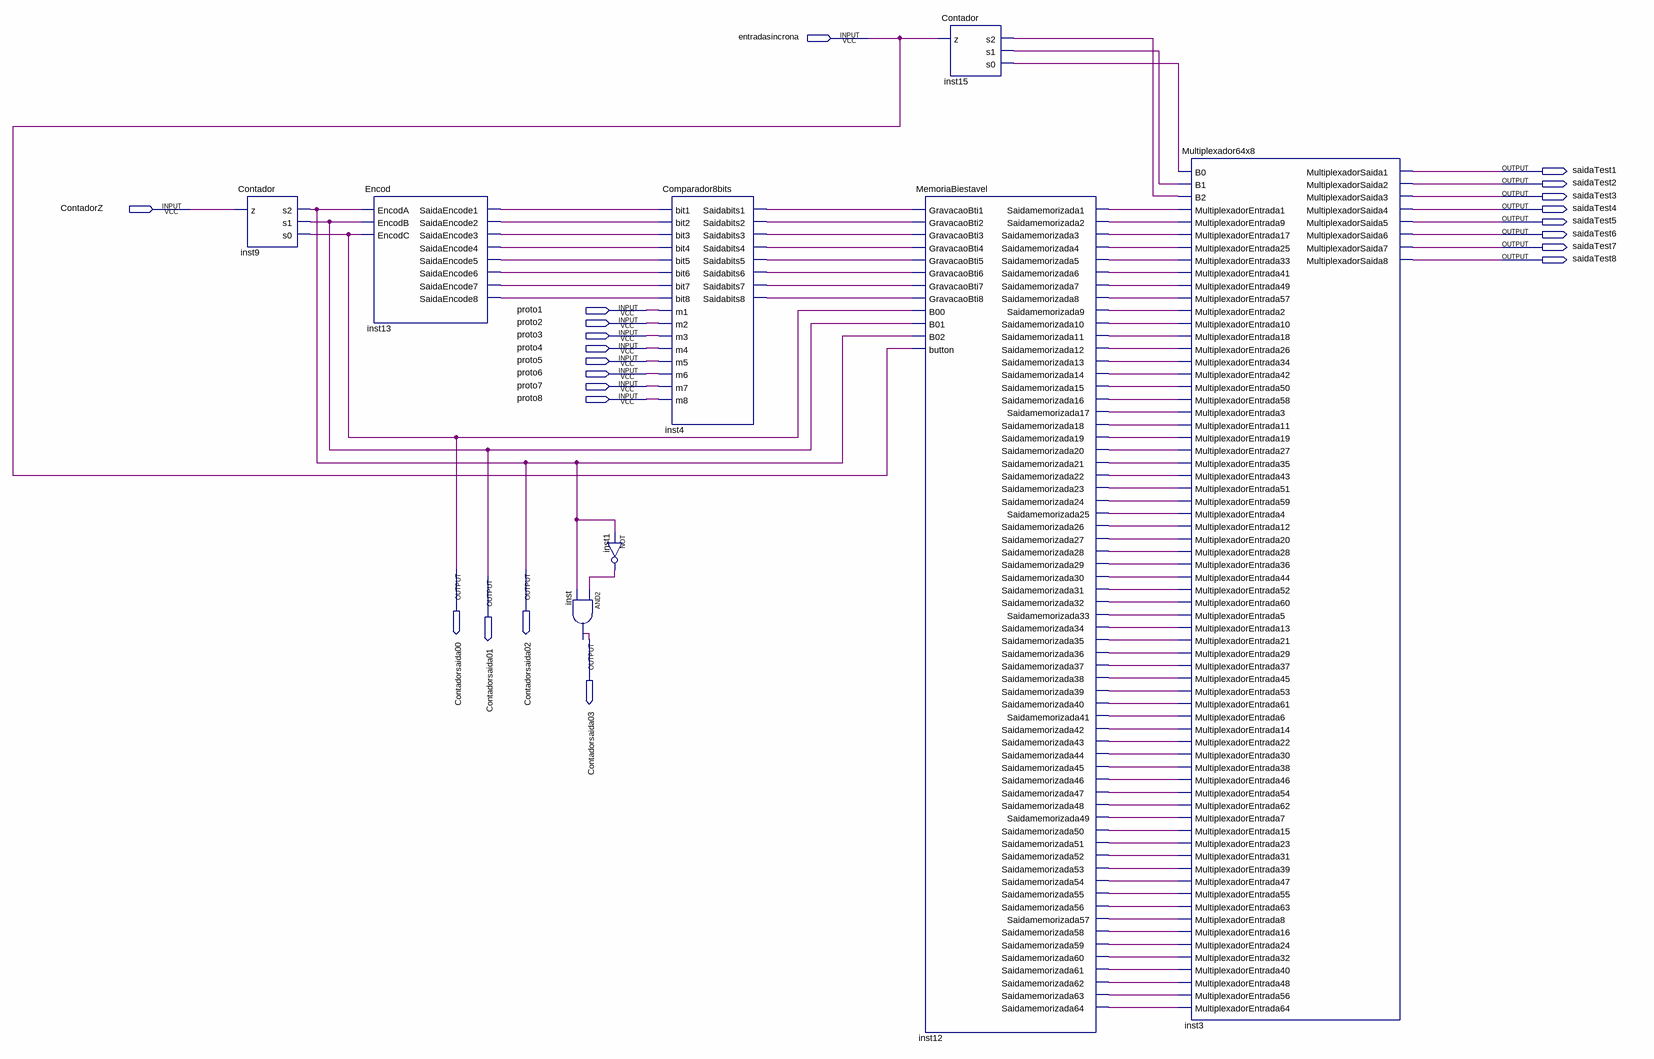
[diagram p0: schematic sheet]
// Quartus schematic PBL3.bdf as structural Verilog: 8 symbols, 22 pins
module PBL3 (
  input  entradasincrona,
  input  ContadorZ,
  input  proto1,
  input  proto2,
  input  proto3,
  input  proto4,
  input  proto5,
  input  proto6,
  input  proto7,
  input  proto8,
  output saidaTest1,
  output saidaTest2,
  output saidaTest3,
  output saidaTest4,
  output saidaTest5,
  output saidaTest6,
  output saidaTest7,
  output saidaTest8,
  output Contadorsaida00,
  output Contadorsaida02,
  output Contadorsaida01,
  output Contadorsaida03
);

  wire inst1_out, inst4_saidabits1, inst4_saidabits2, inst4_saidabits3, inst4_saidabits4, inst4_saidabits5,
       inst4_saidabits6, inst4_saidabits7, inst4_saidabits8, inst12_saidamemorizada1,
       inst12_saidamemorizada2, inst12_saidamemorizada3, inst12_saidamemorizada4, inst12_saidamemorizada5,
       inst12_saidamemorizada6, inst12_saidamemorizada7, inst12_saidamemorizada8, inst12_saidamemorizada9,
       inst12_saidamemorizada10, inst12_saidamemorizada11, inst12_saidamemorizada12,
       inst12_saidamemorizada13, inst12_saidamemorizada14, inst12_saidamemorizada15,
       inst12_saidamemorizada16, inst12_saidamemorizada17, inst12_saidamemorizada18,
       inst12_saidamemorizada19, inst12_saidamemorizada20, inst12_saidamemorizada21,
       inst12_saidamemorizada22, inst12_saidamemorizada23, inst12_saidamemorizada24,
       inst12_saidamemorizada25, inst12_saidamemorizada26, inst12_saidamemorizada27,
       inst12_saidamemorizada28, inst12_saidamemorizada29, inst12_saidamemorizada30,
       inst12_saidamemorizada31, inst12_saidamemorizada32, inst12_saidamemorizada33,
       inst12_saidamemorizada34, inst12_saidamemorizada35, inst12_saidamemorizada36,
       inst12_saidamemorizada37, inst12_saidamemorizada38, inst12_saidamemorizada39,
       inst12_saidamemorizada40, inst12_saidamemorizada41, inst12_saidamemorizada42,
       inst12_saidamemorizada43, inst12_saidamemorizada44, inst12_saidamemorizada45,
       inst12_saidamemorizada46, inst12_saidamemorizada47, inst12_saidamemorizada48,
       inst12_saidamemorizada49, inst12_saidamemorizada50, inst12_saidamemorizada51,
       inst12_saidamemorizada52, inst12_saidamemorizada53, inst12_saidamemorizada54,
       inst12_saidamemorizada55, inst12_saidamemorizada56, inst12_saidamemorizada57,
       inst12_saidamemorizada58, inst12_saidamemorizada59, inst12_saidamemorizada60,
       inst12_saidamemorizada61, inst12_saidamemorizada62, inst12_saidamemorizada63,
       inst12_saidamemorizada64, inst13_saidaencode1, inst13_saidaencode2, inst13_saidaencode3,
       inst13_saidaencode4, inst13_saidaencode5, inst13_saidaencode6, inst13_saidaencode7,
       inst13_saidaencode8, inst15_s0, inst15_s1, inst15_s2;

  Contador inst9 (.z(ContadorZ), .s0(Contadorsaida00), .s2(Contadorsaida02), .s1(Contadorsaida01));
  Encod inst13 (
    .EncodA(Contadorsaida02), .EncodB(Contadorsaida01), .EncodC(Contadorsaida00),
    .SaidaEncode1(inst13_saidaencode1), .SaidaEncode2(inst13_saidaencode2),
    .SaidaEncode3(inst13_saidaencode3), .SaidaEncode4(inst13_saidaencode4),
    .SaidaEncode5(inst13_saidaencode5), .SaidaEncode6(inst13_saidaencode6),
    .SaidaEncode7(inst13_saidaencode7), .SaidaEncode8(inst13_saidaencode8));
  not inst1 (inst1_out, Contadorsaida02);
  and inst (Contadorsaida03, inst1_out, Contadorsaida02);
  Comparador8bits inst4 (
    .bit1(inst13_saidaencode1), .m8(proto8), .bit2(inst13_saidaencode2), .bit3(inst13_saidaencode3),
    .bit4(inst13_saidaencode4), .bit5(inst13_saidaencode5), .bit6(inst13_saidaencode6),
    .bit7(inst13_saidaencode7), .bit8(inst13_saidaencode8), .m1(proto1), .m2(proto2), .m3(proto3),
    .m5(proto5), .m6(proto6), .m7(proto7), .m4(proto4), .Saidabits1(inst4_saidabits1),
    .Saidabits2(inst4_saidabits2), .Saidabits3(inst4_saidabits3), .Saidabits4(inst4_saidabits4),
    .Saidabits5(inst4_saidabits5), .Saidabits6(inst4_saidabits6), .Saidabits7(inst4_saidabits7),
    .Saidabits8(inst4_saidabits8));
  MemoriaBiestavel inst12 (
    .GravacaoBti1(inst4_saidabits1), .GravacaoBti2(inst4_saidabits2), .GravacaoBti3(inst4_saidabits3),
    .GravacaoBti4(inst4_saidabits4), .GravacaoBti5(inst4_saidabits5), .GravacaoBti6(inst4_saidabits6),
    .GravacaoBti7(inst4_saidabits7), .GravacaoBti8(inst4_saidabits8), .B00(Contadorsaida00),
    .B01(Contadorsaida01), .B02(Contadorsaida02), .button(entradasincrona),
    .Saidamemorizada1(inst12_saidamemorizada1), .Saidamemorizada19(inst12_saidamemorizada19),
    .Saidamemorizada28(inst12_saidamemorizada28), .Saidamemorizada37(inst12_saidamemorizada37),
    .Saidamemorizada46(inst12_saidamemorizada46), .Saidamemorizada64(inst12_saidamemorizada64),
    .Saidamemorizada2(inst12_saidamemorizada2), .Saidamemorizada3(inst12_saidamemorizada3),
    .Saidamemorizada4(inst12_saidamemorizada4), .Saidamemorizada5(inst12_saidamemorizada5),
    .Saidamemorizada6(inst12_saidamemorizada6), .Saidamemorizada7(inst12_saidamemorizada7),
    .Saidamemorizada8(inst12_saidamemorizada8), .Saidamemorizada9(inst12_saidamemorizada9),
    .Saidamemorizada10(inst12_saidamemorizada10), .Saidamemorizada11(inst12_saidamemorizada11),
    .Saidamemorizada12(inst12_saidamemorizada12), .Saidamemorizada13(inst12_saidamemorizada13),
    .Saidamemorizada14(inst12_saidamemorizada14), .Saidamemorizada15(inst12_saidamemorizada15),
    .Saidamemorizada16(inst12_saidamemorizada16), .Saidamemorizada17(inst12_saidamemorizada17),
    .Saidamemorizada18(inst12_saidamemorizada18), .Saidamemorizada20(inst12_saidamemorizada20),
    .Saidamemorizada21(inst12_saidamemorizada21), .Saidamemorizada22(inst12_saidamemorizada22),
    .Saidamemorizada23(inst12_saidamemorizada23), .Saidamemorizada24(inst12_saidamemorizada24),
    .Saidamemorizada25(inst12_saidamemorizada25), .Saidamemorizada26(inst12_saidamemorizada26),
    .Saidamemorizada27(inst12_saidamemorizada27), .Saidamemorizada29(inst12_saidamemorizada29),
    .Saidamemorizada30(inst12_saidamemorizada30), .Saidamemorizada31(inst12_saidamemorizada31),
    .Saidamemorizada63(inst12_saidamemorizada63), .Saidamemorizada62(inst12_saidamemorizada62),
    .Saidamemorizada61(inst12_saidamemorizada61), .Saidamemorizada60(inst12_saidamemorizada60),
    .Saidamemorizada32(inst12_saidamemorizada32), .Saidamemorizada33(inst12_saidamemorizada33),
    .Saidamemorizada34(inst12_saidamemorizada34), .Saidamemorizada35(inst12_saidamemorizada35),
    .Saidamemorizada36(inst12_saidamemorizada36), .Saidamemorizada38(inst12_saidamemorizada38),
    .Saidamemorizada39(inst12_saidamemorizada39), .Saidamemorizada40(inst12_saidamemorizada40),
    .Saidamemorizada41(inst12_saidamemorizada41), .Saidamemorizada42(inst12_saidamemorizada42),
    .Saidamemorizada43(inst12_saidamemorizada43), .Saidamemorizada44(inst12_saidamemorizada44),
    .Saidamemorizada45(inst12_saidamemorizada45), .Saidamemorizada47(inst12_saidamemorizada47),
    .Saidamemorizada48(inst12_saidamemorizada48), .Saidamemorizada49(inst12_saidamemorizada49),
    .Saidamemorizada50(inst12_saidamemorizada50), .Saidamemorizada51(inst12_saidamemorizada51),
    .Saidamemorizada52(inst12_saidamemorizada52), .Saidamemorizada53(inst12_saidamemorizada53),
    .Saidamemorizada54(inst12_saidamemorizada54), .Saidamemorizada55(inst12_saidamemorizada55),
    .Saidamemorizada56(inst12_saidamemorizada56), .Saidamemorizada57(inst12_saidamemorizada57),
    .Saidamemorizada58(inst12_saidamemorizada58), .Saidamemorizada59(inst12_saidamemorizada59));
  Contador inst15 (.z(entradasincrona), .s0(inst15_s0), .s2(inst15_s2), .s1(inst15_s1));
  Multiplexador64x8 inst3 (
    .B0(inst15_s0), .B1(inst15_s1), .B2(inst15_s2), .MultiplexadorEntrada1(inst12_saidamemorizada1),
    .MultiplexadorEntrada10(inst12_saidamemorizada10), .MultiplexadorEntrada19(inst12_saidamemorizada19),
    .MultiplexadorEntrada28(inst12_saidamemorizada28), .MultiplexadorEntrada37(inst12_saidamemorizada37),
    .MultiplexadorEntrada46(inst12_saidamemorizada46), .MultiplexadorEntrada64(inst12_saidamemorizada64),
    .MultiplexadorEntrada9(inst12_saidamemorizada2), .MultiplexadorEntrada17(inst12_saidamemorizada3),
    .MultiplexadorEntrada25(inst12_saidamemorizada4), .MultiplexadorEntrada33(inst12_saidamemorizada5),
    .MultiplexadorEntrada41(inst12_saidamemorizada6), .MultiplexadorEntrada49(inst12_saidamemorizada7),
    .MultiplexadorEntrada57(inst12_saidamemorizada8), .MultiplexadorEntrada2(inst12_saidamemorizada9),
    .MultiplexadorEntrada18(inst12_saidamemorizada11), .MultiplexadorEntrada26(inst12_saidamemorizada12),
    .MultiplexadorEntrada34(inst12_saidamemorizada13), .MultiplexadorEntrada42(inst12_saidamemorizada14),
    .MultiplexadorEntrada50(inst12_saidamemorizada15), .MultiplexadorEntrada58(inst12_saidamemorizada16),
    .MultiplexadorEntrada3(inst12_saidamemorizada17), .MultiplexadorEntrada11(inst12_saidamemorizada18),
    .MultiplexadorEntrada27(inst12_saidamemorizada20), .MultiplexadorEntrada35(inst12_saidamemorizada21),
    .MultiplexadorEntrada43(inst12_saidamemorizada22), .MultiplexadorEntrada51(inst12_saidamemorizada23),
    .MultiplexadorEntrada59(inst12_saidamemorizada24), .MultiplexadorEntrada4(inst12_saidamemorizada25),
    .MultiplexadorEntrada12(inst12_saidamemorizada26), .MultiplexadorEntrada20(inst12_saidamemorizada27),
    .MultiplexadorEntrada36(inst12_saidamemorizada29), .MultiplexadorEntrada44(inst12_saidamemorizada30),
    .MultiplexadorEntrada52(inst12_saidamemorizada31), .MultiplexadorEntrada60(inst12_saidamemorizada32),
    .MultiplexadorEntrada5(inst12_saidamemorizada33), .MultiplexadorEntrada13(inst12_saidamemorizada34),
    .MultiplexadorEntrada21(inst12_saidamemorizada35), .MultiplexadorEntrada29(inst12_saidamemorizada36),
    .MultiplexadorEntrada45(inst12_saidamemorizada38), .MultiplexadorEntrada53(inst12_saidamemorizada39),
    .MultiplexadorEntrada61(inst12_saidamemorizada40), .MultiplexadorEntrada6(inst12_saidamemorizada41),
    .MultiplexadorEntrada14(inst12_saidamemorizada42), .MultiplexadorEntrada22(inst12_saidamemorizada43),
    .MultiplexadorEntrada30(inst12_saidamemorizada44), .MultiplexadorEntrada38(inst12_saidamemorizada45),
    .MultiplexadorEntrada54(inst12_saidamemorizada47), .MultiplexadorEntrada62(inst12_saidamemorizada48),
    .MultiplexadorEntrada7(inst12_saidamemorizada49), .MultiplexadorEntrada15(inst12_saidamemorizada50),
    .MultiplexadorEntrada23(inst12_saidamemorizada51), .MultiplexadorEntrada31(inst12_saidamemorizada52),
    .MultiplexadorEntrada39(inst12_saidamemorizada53), .MultiplexadorEntrada47(inst12_saidamemorizada54),
    .MultiplexadorEntrada55(inst12_saidamemorizada55), .MultiplexadorEntrada63(inst12_saidamemorizada56),
    .MultiplexadorEntrada8(inst12_saidamemorizada57), .MultiplexadorEntrada16(inst12_saidamemorizada58),
    .MultiplexadorEntrada24(inst12_saidamemorizada59), .MultiplexadorEntrada32(inst12_saidamemorizada60),
    .MultiplexadorEntrada40(inst12_saidamemorizada61), .MultiplexadorEntrada48(inst12_saidamemorizada62),
    .MultiplexadorEntrada56(inst12_saidamemorizada63), .MultiplexadorSaida1(saidaTest1),
    .MultiplexadorSaida2(saidaTest2), .MultiplexadorSaida3(saidaTest3), .MultiplexadorSaida4(saidaTest4),
    .MultiplexadorSaida5(saidaTest5), .MultiplexadorSaida6(saidaTest6), .MultiplexadorSaida7(saidaTest7),
    .MultiplexadorSaida8(saidaTest8));
endmodule
